# EAGLE design expansion (EAGLE 9.6.2)
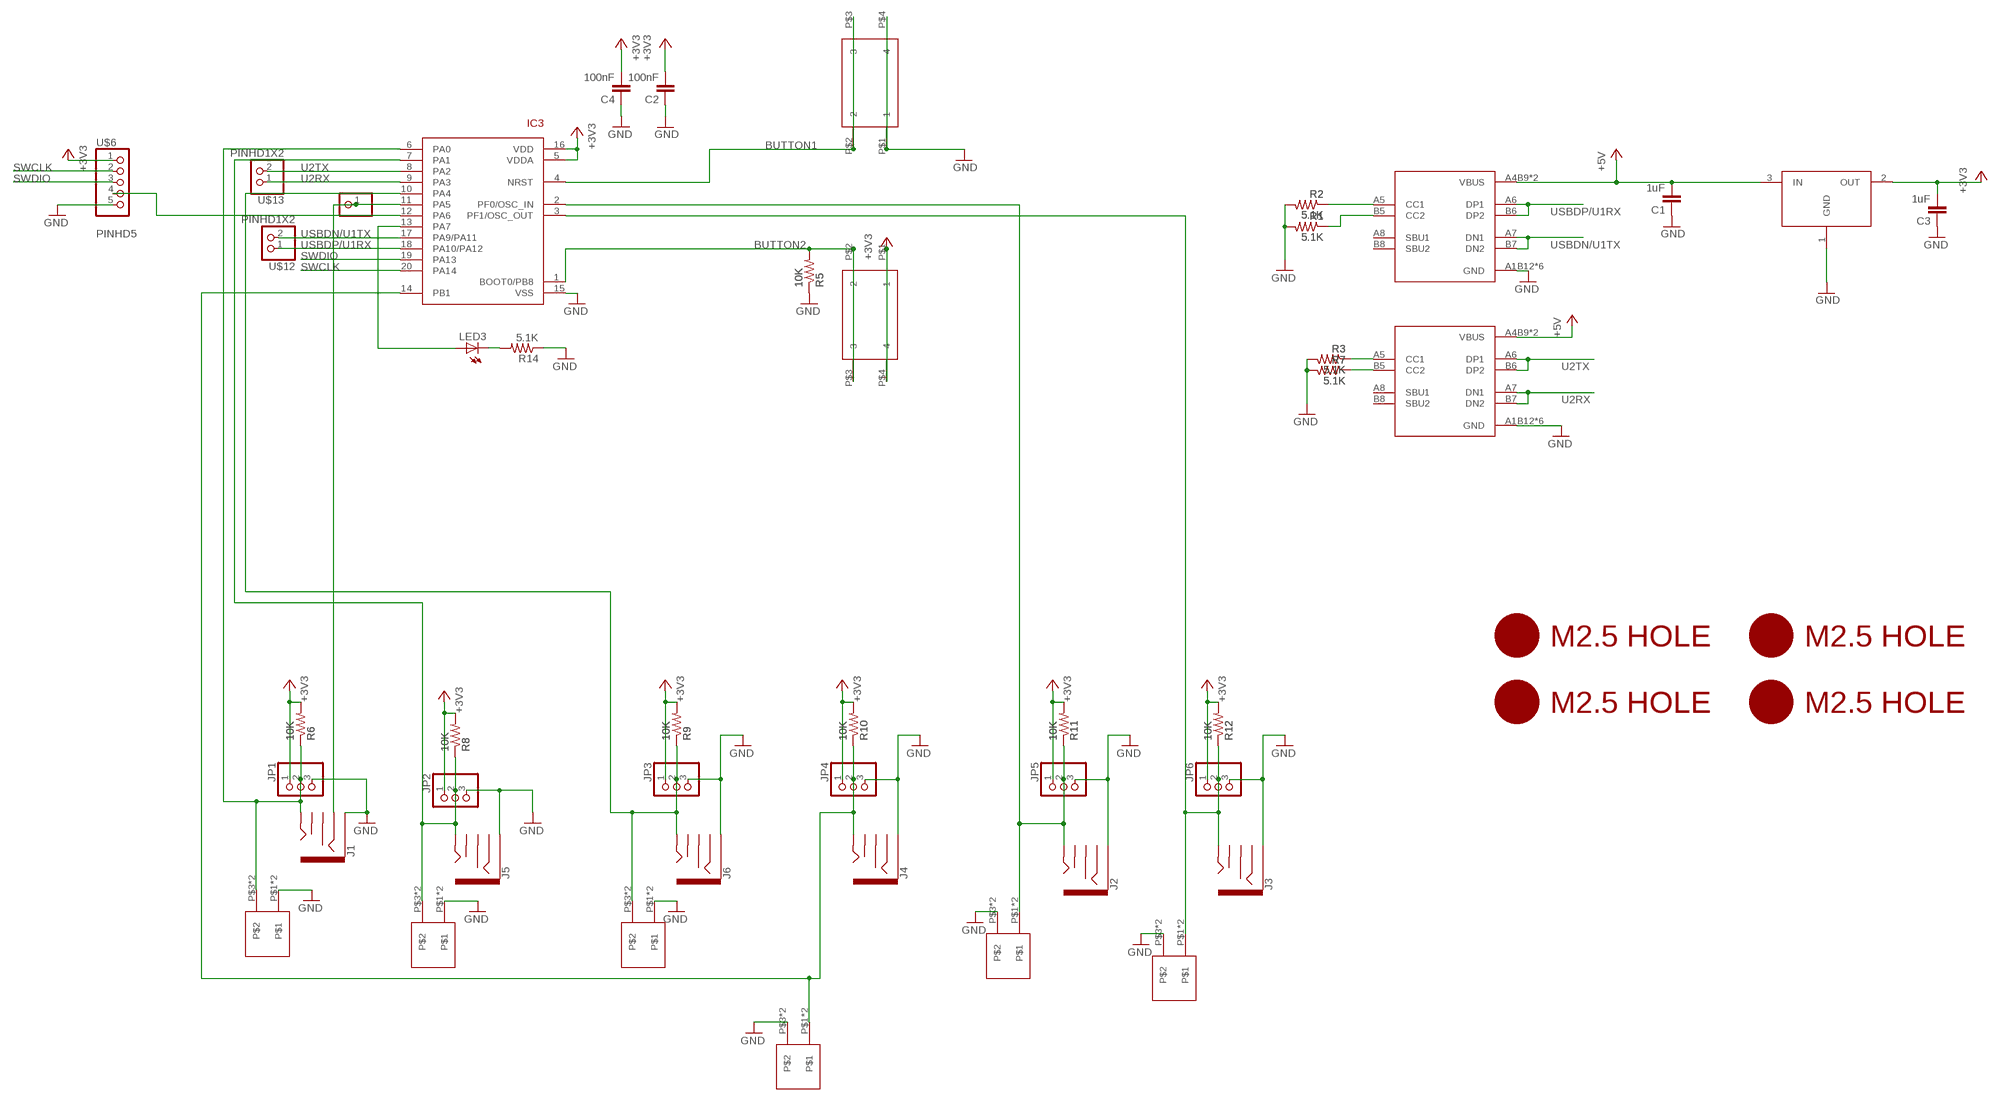
[diagram p0: schematic, sheet 1]

## Parts
C1  1uF  CAP0805  [0805]
C2  100nF  CAP0805  [0805]
C3  1uF  CAP0805  [0805]
C4  100nF  CAP0805  [0805]
IC3  STM32F042F4  [TSSOP20]
J1  AUDIO_JACK_3.5MM_PTH  [AUDIO-JACK]
J2  AUDIO_JACK_3.5MM_PTH  [AUDIO-JACK]
J3  AUDIO_JACK_3.5MM_PTH  [AUDIO-JACK]
J4  AUDIO_JACK_3.5MM_PTH  [AUDIO-JACK]
J5  AUDIO_JACK_3.5MM_PTH  [AUDIO-JACK]
J6  AUDIO_JACK_3.5MM_PTH  [AUDIO-JACK]
JP1  PINHD-1X3  [1X03]
JP2  PINHD-1X3  [1X03]
JP3  PINHD-1X3  [1X03]
JP4  PINHD-1X3  [1X03]
JP5  PINHD-1X3  [1X03]
JP6  PINHD-1X3  [1X03]
JP7  PINHD-1X1CB  [1X01-CLEANBIG]
LED3  LEDCHIP-LED0805  [CHIP-LED0805]
R1  5.1K  RESISTOR0805-RES  [0805]
R2  5.1K  RESISTOR0805-RES  [0805]
R3  5.1K  RESISTOR0805-RES  [0805]
R5  10K  RESISTOR0805-RES  [0805]
R6  10K  RESISTOR0805-RES  [0805]
R7  5.1K  RESISTOR0805-RES  [0805]
R8  10K  RESISTOR0805-RES  [0805]
R9  10K  RESISTOR0805-RES  [0805]
R10  10K  RESISTOR0805-RES  [0805]
R11  10K  RESISTOR0805-RES  [0805]
R12  10K  RESISTOR0805-RES  [0805]
R14  5.1K  RESISTOR0805-RES  [0805]
SW3  324_SW  [342_SWICH_FOOT]
SW4  324_SW  [342_SWICH_FOOT]
U1  USBC_16P  [USBC_16P_FOOT]
U2  USBC_16P  [USBC_16P_FOOT]
U4  XC6206_DEV  [SOT23R_INFINEON]
U$1  DG2204R-2  [DG2204R-2]
U$2  DG2204R-2  [DG2204R-2]
U$3  DG2204R-2  [DG2204R-2]
U$4  DG2204R-2  [DG2204R-2]
U$5  DG2204R-2  [DG2204R-2]
U$6  PINHD5  [1X05]
U$7  DG2204R-2  [DG2204R-2]
U$8  M2.5HOLE  [M2.5HOLE]
U$9  M2.5HOLE  [M2.5HOLE]
U$10  M2.5HOLE  [M2.5HOLE]
U$11  M2.5HOLE  [M2.5HOLE]
U$12  PINHD1X2  [1X02]
U$13  PINHD1X2  [1X02]

## Nets
+3V3: C2.2 C3.2 C4.2 IC3.5(VDDA) IC3.16(VDD) JP1.1 JP2.1 JP3.1 JP4.1 JP5.1 JP6.1 R6.2 R8.2 R9.2 R10.2 R11.2 R12.2 SW4.P$1 SW4.P$4 U4.2(OUT) U$6.1
+5V: C1.2 U1.A4B9(VBUS) U1.B4A9(VBUS) U2.A4B9(VBUS) U2.B4A9(VBUS) U4.3(IN)
BUTTON1: IC3.4(NRST) SW3.P$2 SW3.P$3
BUTTON2: IC3.1(BOOT0/PB8) R5.2 SW4.P$2 SW4.P$3
CH1: IC3.6(PA0) J1.TIP JP1.2 R6.1 U$4.P$3 U$4.P$4
CH2: IC3.7(PA1) J5.TIP JP2.2 R8.1 U$5.P$3 U$5.P$4
CH3: IC3.10(PA4) J6.TIP JP3.2 R9.1 U$7.P$3 U$7.P$4
CH4: IC3.14(PB1) J4.TIP JP4.2 R10.1 U$1.P$1 U$1.P$2
CH5: IC3.2(PF0/OSC_IN) J2.TIP JP5.2 R11.1 U$2.P$1 U$2.P$2
CH6: IC3.3(PF1/OSC_OUT) J3.TIP JP6.2 R12.1 U$3.P$1 U$3.P$2
GND: C1.1 C2.1 C3.1 C4.1 IC3.15(VSS) J1.SLEEVE J2.SLEEVE J3.SLEEVE J4.SLEEVE J5.SLEEVE J6.SLEEVE JP1.3 JP2.3 JP3.3 JP4.3 JP5.3 JP6.3 R1.2 R2.2 R3.2 R5.1 R7.2 R14.1 SW3.P$1 SW3.P$4 U1.A1B12(GND) U1.B11A12(GND) U1.P$13(GND) U1.P$14(GND) U1.P$15(GND) U1.P$16(GND) U2.A1B12(GND) U2.B11A12(GND) U2.P$13(GND) U2.P$14(GND) U2.P$15(GND) U2.P$16(GND) U4.1(GND) U$1.P$3 U$1.P$4 U$2.P$3 U$2.P$4 U$3.P$3 U$3.P$4 U$4.P$1 U$4.P$2 U$5.P$1 U$5.P$2 U$6.5 U$7.P$1 U$7.P$2
N$1: R3.1 U1.A5(CC1)
N$2: R7.1 U1.B5(CC2)
N$11: LED3.C R14.2
N$12: IC3.13(PA7) LED3.A
N$13: IC3.11(PA5) J1.RING JP7.1
N$14: IC3.12(PA6) U$6.4
N$31: R1.1 U2.B5(CC2)
N$33: R2.1 U2.A5(CC1)
SWCLK: IC3.20(PA14) U$6.2
SWDIO: IC3.19(PA13) U$6.3
U2RX: IC3.9(PA3) U1.A7(DN1) U1.B7(DN2) U$13.1
U2TX: IC3.8(PA2) U1.A6(DP1) U1.B6(DP2) U$13.2
USBDN/U1TX: IC3.17(PA9/PA11) U2.A7(DN1) U2.B7(DN2) U$12.2
USBDP/U1RX: IC3.18(PA10/PA12) U2.A6(DP1) U2.B6(DP2) U$12.1
Unconnected: J1.RSH J1.TSH J2.RING J2.RSH J2.TSH J3.RING J3.RSH J3.TSH J4.RING J4.RSH J4.TSH J5.RING J5.RSH J5.TSH J6.RING J6.RSH J6.TSH U1.A8(SBU1) U1.B8(SBU2) U2.A8(SBU1) U2.B8(SBU2)

## Library data of the parts
C1-C4 = clock:CAP: Capacitor Standard 0603 ceramic capacitor, and 0.1" leaded capacitor.
IC3 = tx:STM32F042F4
J1-J6 = SparkFun-Connectors:AUDIO_JACK_3.5MM: Audio Jack 3.5mm variants of PTH and SMT stereo audio jack with bypass switches. SparkFun Products: SparkFun SparkPunk Sound Kit <[https://www.sparkfun.com/products/11177]> - PTH MP3 Trigger <https://www.sparkfun.com/products/13720> -3.5mm SMD SparkFun PicoBoard <https://www.sparkfun.com/products/11888>- 2.5mm SMD; PROD_ID: CONN-08774; SF_ID: PRT-08032
JP1-JP6 = pinhead:PINHD-1X3: PIN HEADER
JP7 = adafruit_changed:PINHD-1X1: Pin header 1x1 for 0.1" spacing With round pins
LED3 = adafruit:LED: LED OSRAM: - CHIPLED LG R971, LG N971, LY N971, LG Q971, LY Q971, LO R971, LY R971 LH N974, LH R974 LS Q976, LO Q976, LY Q976 LO Q996 - Hyper CHIPLED LW Q18S LB Q993, LB Q99A, LB R99A - SideLED LS A670, LO A670, LY A670, LG A670, LP A670 LB A673, LV A673, LT A673, LW A673 LH A674 LY A675 LS A676, LA A676, LO A676, LY A676, LW A676 LS A679, LY A679, LG A679 - Hyper Micro SIDELED® LS Y876, LA Y876, LO Y876, LY Y876 LT Y87S - SmartLED LW L88C, LW L88S LB L89C, LB L89S, LG L890 LS L89K, LO L89K, LY L89K LS L896, LA L896, LO L896, LY L896 - TOPLED LS T670, LO T670, LY T670, LG T670, LP T670 LSG T670, LSP T670, LSY T670, LOP T670, LYG T670 LG T671, LOG T671, LSG T671 LB T673, LV T673, LT T673, LW T673 LH T674 LS T676, LA T676, LO T676, LY T676, LB T676, LH T676, LSB T676, LW T676 LB T67C, LV T67C, LT T67C, LS T67K, LO T67K, LY T67K, LW E67C LS E67B, LA E67B, LO E67B, LY E67B, LB E67C, LV E67C, LT E67C LW T67C LS T679, LY T679, LG T679 LS T770, LO T770, LY T770, LG T770, LP T770 LB T773, LV T773, LT T773, LW T773 LH T774 LS E675, LA E675, LY E675, LS T675 LS T776, LA T776, LO T776, LY T776, LB T776 LHGB T686 LT T68C, LB T68C - Hyper Mini TOPLED® LB M676 - Mini TOPLED Santana® LG M470 LS M47K, LO M47K, LY M47K Source: http://www.osram.convergy.de/
R1-R3 R5-R12 = joyAnalog:RESISTOR: Resistor Basic schematic elements and footprints for 0603, 1206, and PTH resistors.
R14 = SparkFun-Passives:RESISTOR: Resistor Basic schematic elements and footprints for 0603, 1206, and PTH resistors.
SW3 SW4 = 3pos_slide_switch_centered:324_SW
U1 U2 = my_usbc_16p:USBC_16P
U4 = 3pos_slide_switch:XC6206_DEV
U$1-U$5 U$7 = expansion:DG2204R-2
U$6 = adafruit_changed:PINHD5
U$8-U$11 = f1c100s:M2.5HOLE
U$12 U$13 = adafruit_changed:PINHD1X2

## Board
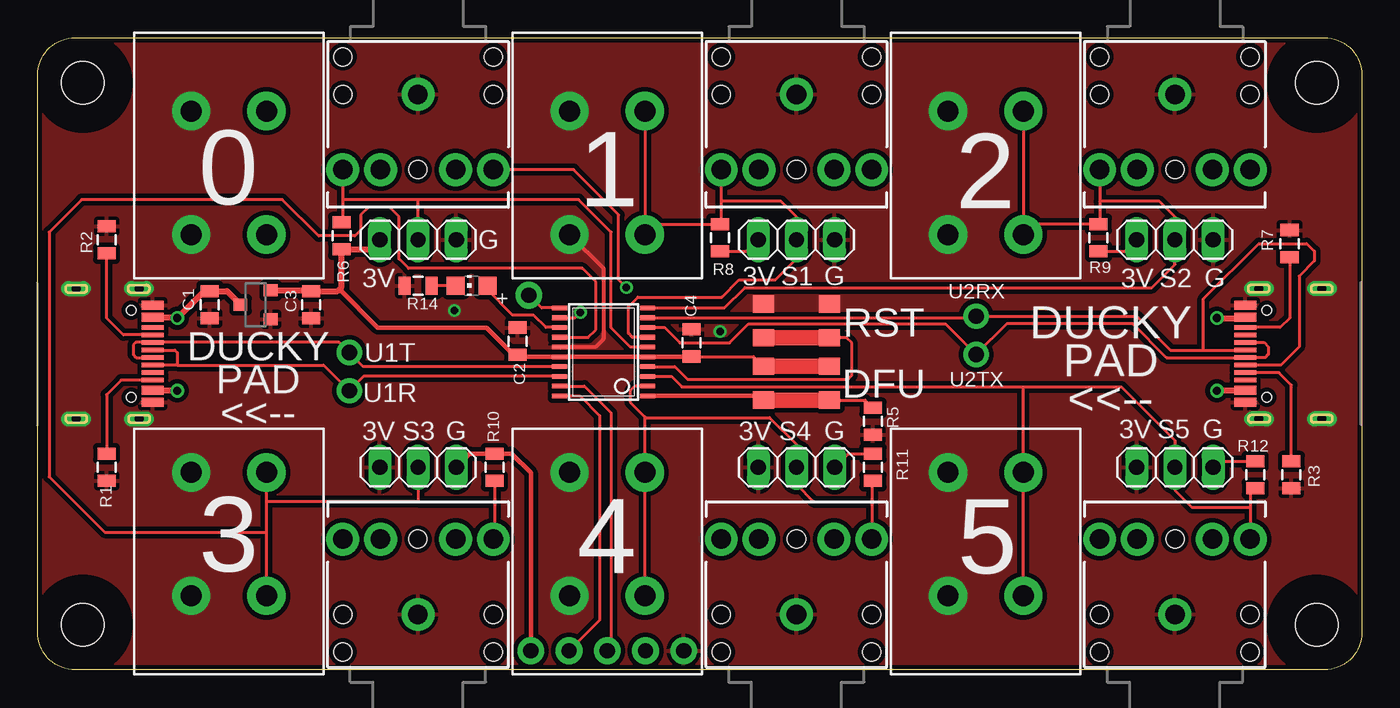
[diagram p1: board, top side]
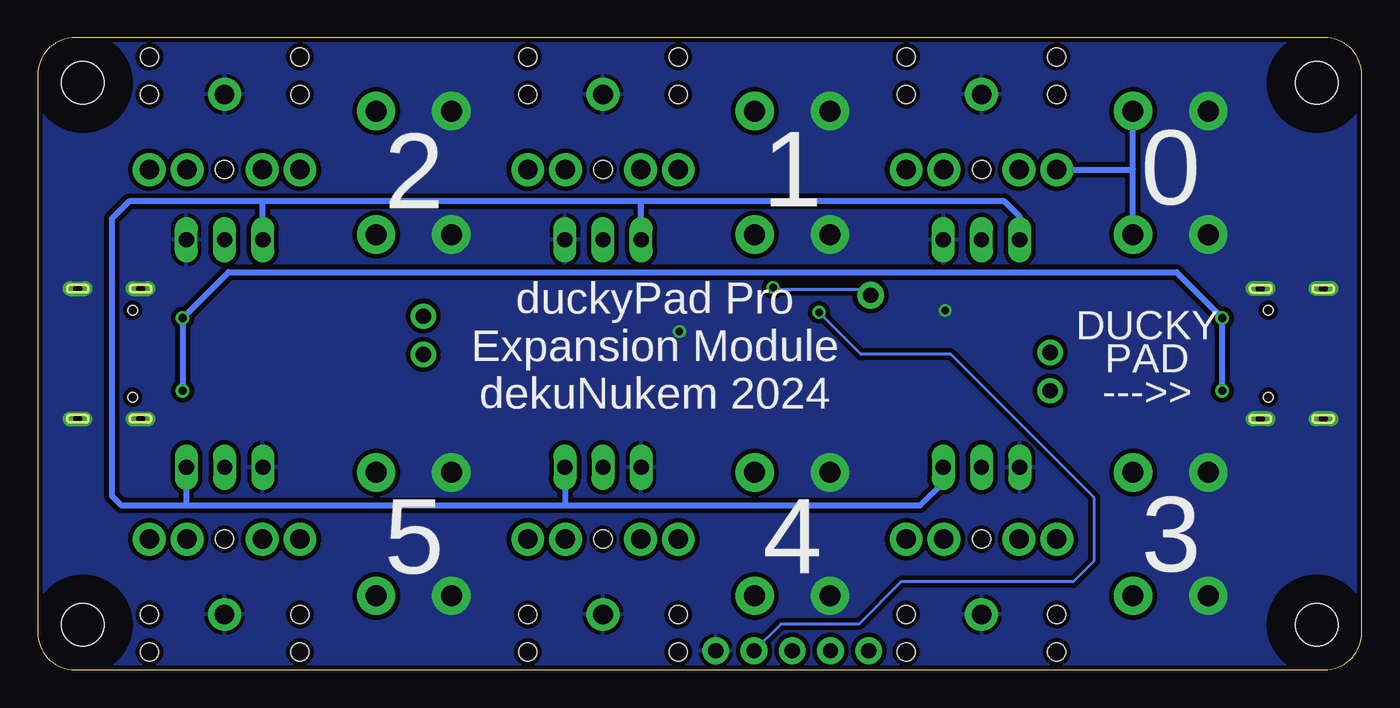
[diagram p2: board, bottom side, seen from below]

Size 88 x 42 mm. Coordinates in mm from the lower left corner, seen from the top.
Outline: 2.5,42 85.5,42 arc-90 88,39.5 88,2.5 arc-90 85.5,0 2.5,0 arc-90 0,2.5 0,39.5 arc-90 2.5,42
Copper layers (1*16): Top 0.035mm / dielectric 1.5mm / Bottom 0.035mm
Design rules "deku_2layer_6mil": minimum track width 6mil, minimum drill 15mil, track to track 6mil, track to pad 6mil, pad to pad 6mil, via to via 6mil, smd to smd 6mil, copper to edge 10mil, drill to drill 6mil, minimum pad ring 7mil, minimum via ring 7mil, stop-mask expansion 4mil, vias tented up to drill 25mil, thermal gap 10mil

### Footprints (pad centres in the part's own frame; a part is rotated, then mirrored left to right if it is on the bottom)
0805 = smd 0.8 x 1.2: 1 -0.9,0; 2 0.9,0
TSSOP20 = smd 0.305 x 0.991: 1 -2.925,-2.918; 2 -2.275,-2.918; 3 -1.625,-2.918; 4 -0.975,-2.918; 5 -0.325,-2.918; 6 0.325,-2.918; 7 0.975,-2.918; 8 1.625,-2.918; 9 2.275,-2.918; 10 2.925,-2.918; 11 2.925,2.918; 12 2.275,2.918; 13 1.625,2.918; 14 0.975,2.918; 15 0.325,2.918; 16 -0.325,2.918; 17 -0.975,2.918; 18 -1.625,2.918; 19 -2.275,2.918; 20 -2.925,2.918
AUDIO-JACK = drill 1.3 pad 2.184: RING 5,5; RSH 5,2.5; SLEEVE 0,0; TIP 5,-5; TSH 5,-2.5 | hole 1.2: 0,5; -2.5,5; -2.5,-5; 0,-5; 5,0
1X03 = drill 1.016 long: 1 -2.54,0; 2 0,0; 3 2.54,0
1X01-CLEANBIG = drill 1.016 pad 1.778: 1 0,0
CHIP-LED0805 = smd 1.2 x 1.2: A 0,-1.05; C 0,1.05
342_SWICH_FOOT = smd 1.4 x 1.15: P$1 -2.2,-1.125; P$2 -2.2,1.125; P$3 2.2,1.125; P$4 2.2,-1.125
USBC_16P_FOOT = smd 0.6 x 1.45: A1B12 -3.225,3.848; A4B9 -2.425,3.848; B4A9 2.425,3.848; B11A12 3.225,3.848 | smd 0.3 x 1.45: A5 -1.25,3.848; A6 -0.25,3.848; A7 0.25,3.848; A8 1.25,3.848; B5 1.75,3.848; B6 0.75,3.848; B7 -0.75,3.848; B8 -1.75,3.848 | drill 0.6 pad 1 long: P$13 -4.32,2.933; P$14 4.32,2.933; P$15 -4.32,-1.248; P$16 4.32,-1.248 | hole 0.65: -2.89,2.402; 2.89,2.402
SOT23R_INFINEON = smd 0.8 x 0.9: 1 -0.95,-1; 2 0.95,-1; 3 0,1
DG2204R-2 = drill 1.4 pad 2.54: P$1 -2.5,4.1; P$2 -2.5,-4.1; P$3 2.5,4.1; P$4 2.5,-4.1
1X05 = drill 1.016 pad 1.778: 1 -6.35,0; 2 -3.81,0; 3 -1.27,0; 4 1.27,0; 5 3.81,0
M2.5HOLE = hole 2.8: 0,0
1X02 = drill 1.016 pad 1.676: 1 -1.27,0; 2 1.27,0

### Placement (x,y rotation side)
C1  11.44,24.26 90 top
C2  31.88,21.84 270 top
C3  18.17,24.26 90 top
C4  43.44,21.72 270 top
IC3  37.61,21.12 90 top
J1  25.28,38.23 270 top
J2  50.43,3.68 90 top
J3  75.57,3.68 90 top
J4  25.28,3.68 90 top
J5  50.43,38.23 270 top
J6  75.57,38.23 270 top
JP1  25.28,28.57 0 top
JP2  50.43,28.57 0 top
JP3  75.57,28.57 0 top
JP4  25.28,13.46 180 top
JP5  50.43,13.46 180 top
JP6  75.57,13.46 180 top
JP7  32.65,24.89 0 top
LED3  28.84,25.53 90 top
R1  4.58,13.46 270 top
R2  4.58,28.57 90 top
R3  83.32,12.95 270 top
R5  55.51,16.51 90 top
R6  20.2,28.83 270 top
R7  83.19,28.32 90 top
R8  45.35,28.7 270 top
R9  70.49,28.7 270 top
R10  30.36,13.46 90 top
R11  55.51,13.46 90 top
R12  80.91,12.95 90 top
R14  25.28,25.53 0 top
SW3  50.43,23.19 180 top
SW4  50.43,19.05 180 top
U1  84.09,21 90 top
U2  3.81,21 270 top
U4  14.49,24.26 90 top
U$1  12.71,9.02 180 top
U$2  37.85,9.02 180 top
U$3  63,9.02 180 top
U$4  12.71,33.02 0 top
U$5  37.85,33.02 0 top
U$6  39.12,1.27 0 top
U$7  63,33.02 0 top
U$8  3,3 0 top
U$9  3,39 0 top
U$10  85,3 0 top
U$11  85,39 0 top
U$12  20.71,19.81 90 top
U$13  62.37,22.23 270 top

### Tracks (layer width: path | path; a pad name or v marks a point on that pad's centre or on a via)
+3V3
  Top 0.203: JP6.1 78.5,13.85 R12.2 | JP5.1 53.87,14.36 R11.2 | R9.2 72.26,27.8 JP3.1 | R8.2 47.11,27.8 JP2.1 | C4.2 47.59,20.82 SW4.P$4
  Top 0.305: C4.2 43.42,20.8 IC3.5 IC3.16 32.03,20.8 C2.2 31.63,20.94 29.83,22.74 22.6,22.74 20.06,25.28 | JP4.1 28.72,14.36 R10.2 31.49,14.36 32.77,13.08 U$6.1
  Top 0.406: JP1.1 22.09,27.93 R6.2 20.2,25.42 20.06,25.28 19.94,25.16 C3.2 18.12,25.21 U4.2
  Top 1.016: SW4.P$4 SW4.P$1
  Bottom 0.406: JP1.1 22.74,30.1 23.76,31.11 47.89,31.11 | JP2.1 47.89,31.11 | 78.11,10.92 82.43,10.92 83.07,11.56 83.07,29.97 81.92,31.11 73.03,31.11 | 78.11,10.92 52.97,10.92 | 52.97,10.92 29.34,10.92 27.82,12.45 JP4.1 | 47.89,31.11 73.03,31.11 | JP5.1 52.97,10.92 | JP6.1 78.11,10.92 | JP3.1 73.03,31.11
+5V  (via drill 0.55)
  Top 0.406: U4.3 12.59,25.16 C1.2 11.43,25.15 11.06,25.15 v9.28,23.37 9.22,23.43 U2.A4B9 | U2.B4A9 9.25,18.57 v9.28,18.54 | v78.37,23.37 80.19,23.37 U1.B4A9 | v78.37,18.54 78.4,18.57 U1.A4B9
  Bottom 0.406: v9.28,18.54 v9.28,23.37 12.33,26.42 75.32,26.42 v78.37,23.37 v78.37,18.54
BUTTON1
  Top 0.203: IC3.4 42.35,20.14 43.19,19.3 53.86,19.3 54.11,19.56 54.11,21.72 53.76,22.07 SW3.P$2
  Top 1.016: SW3.P$3 SW3.P$2
BUTTON2
  Top 0.203: SW4.P$2 54.99,17.93 R5.2
  Top 0.305: IC3.1 47.96,18.2 SW4.P$3
  Top 1.016: SW4.P$3 SW4.P$2
CH1
  Top 0.203: IC3.6 39.4,21.45 38.11,22.73 38.11,29.08 35.95,31.24 25.28,31.24 | J1.TIP 20.28,31.24 | 20.28,31.24 20.28,29.81 R6.1 | 25.28,31.24 20.28,31.24 | JP1.2 25.28,31.24
  Bottom 0.406: U$4.P$4 15.21,33.27 | 15.21,33.27 U$4.P$3 | J1.TIP 15.26,33.23 15.21,33.27
CH2
  Top 0.203: IC3.7 39.51,22.09 39.25,22.35 39.25,24.13 39.89,24.77 45.47,24.77 46.62,25.91 49.03,25.91 50.43,27.3 JP2.2 50.43,30.1 49.41,31.11 45.43,31.11 | J5.TIP 45.43,31.11 | 45.43,31.11 45.43,29.68 R8.1 41.04,29.6 U$5.P$4 U$5.P$3
CH3
  Top 0.203: IC3.10 45.64,24.05 47,25.4 74.05,25.4 75.57,26.92 JP3.2 75.57,30.1 74.56,31.11 70.57,31.11 | J6.TIP 70.57,31.11 | 70.57,31.11 70.57,29.68 R9.1 66.02,29.6 65.5,29.08 | U$7.P$3 65.5,29.08 | 65.5,29.08 U$7.P$4
CH4
  Top 0.203: IC3.14 36.58,22.09 37.09,22.61 37.09,25.78 36.2,26.67 24.65,26.67 24.01,27.3 24.01,30.1 23.38,30.73 21.98,30.73 21.47,30.23 21.47,29.21 21.09,28.83 18.68,28.83 16.26,31.24 2.93,31.24 0.77,29.08 0.77,12.83 4.45,9.14 15.21,9.14 | R10.1 30.36,11.18 | 30.36,11.18 30.36,8.76 J4.TIP | 25.28,11.18 30.36,11.18 | JP4.2 25.28,11.18 | 15.21,9.14 15.21,11.18 | 15.21,11.18 U$1.P$2 | U$1.P$1 15.21,9.14 | 25.28,11.18 15.21,11.18
CH5
  Top 0.203: IC3.2 39.68,18.84 39.38,18.54 39.38,17.78 40.33,16.83 40.35,16.8 | 40.35,16.8 40.39,16.76 48.65,16.76 50.43,14.99 JP5.2 50.43,12.32 51.57,11.18 55.43,11.18 | R11.1 55.43,12.48 55.43,11.18 | 55.43,11.18 J2.TIP | U$2.P$1 U$2.P$2 40.35,16.8
CH6
  Top 0.203: IC3.3 42.11,19.5 42.81,18.8 65.54,18.8 | 65.54,18.8 72.02,18.8 75.57,15.24 JP6.2 75.57,11.94 76.72,10.79 80.57,10.79 | 80.57,10.79 J3.TIP | R12.1 80.57,11.72 80.57,10.79 | U$3.P$1 U$3.P$2 65.5,18.76 65.54,18.8
GND  (via drill 0.5)
  Top 0.254: U$5.P$2 37.6,26.67 37.6,21.97 37.07,21.45 IC3.15
  other vias: 45.35,22.48 27.69,23.88
  pour Top (isolate 0.305): -11.35,56 -11.35,-12 116.14,-12 116.14,56
  pour Bottom (isolate 0.305): -10.5,51 105.5,51 105.5,-8 -10.5,-8
N$1
  Top 0.203: R3.1 83.32,18.92 82.49,19.75 U1.A5
N$2
  Top 0.203: R7.1 83.19,23.37 82.58,22.75 U1.B5
N$11
  Top 0.203: LED3.C R14.2
N$12
  Top 0.203: IC3.13 33.78,22.75 32.95,23.57 31.55,23.57 29.89,25.24 LED3.A
N$13  (via drill 0.5)
  Top 0.203: IC3.11 33.49,24.05 JP7.1 | v39.12,25.4 38.62,25.91 38.62,30.23 35.62,33.23 J1.RING
  Bottom 0.203: JP7.1 33.03,25.27 39,25.27 v39.12,25.4
N$14  (via drill 0.5)
  Top 0.203: IC3.12 35.72,23.39 v36.08,23.75
  Bottom 0.203: U$6.4 38.62,3.05 33.41,3.05 30.61,5.84 19.18,5.84 17.79,7.24 17.79,11.43 27.31,20.95 33.28,20.95 v36.08,23.75
N$31
  Top 0.203: U2.B5 5.54,19.25 4.58,18.29 R1.1
N$33
  Top 0.203: U2.A5 5.7,22.25 4.58,23.37 R2.1
SWCLK
  Top 0.203: IC3.20 36.04,18.2 37.35,16.89 37.35,3.3 U$6.2
SWDIO
  Top 0.203: IC3.19 36.34,18.84 38.11,17.08 38.11,1.52 U$6.3
U2RX
  Top 0.203: 77.48,21.25 75.28,21.25 73.03,23.5 U$13.1 62.27,23.39 IC3.9 | 77.48,21.25 U1.A7 | 77.48,21.25 77.48,24.64 81.16,28.32 84.34,28.32 84.84,27.81 84.84,27.18 83.83,26.16 83.83,21.46 82.61,20.25 U1.B7
U2TX
  Top 0.203: IC3.8 41.65,22.75 42.68,21.72 45.98,21.72 47.25,22.99 60.33,22.99 U$13.2 64.4,22.99 72.78,22.99 75.02,20.75 U1.A6 81.59,20.75 81.8,20.95 81.8,21.46 81.51,21.75 U1.B6
USBDN/U1TX
  Top 0.203: U2.A7 6.56,20.75 6.36,20.95 6.36,21.59 6.52,21.75 U2.B7 20.04,21.75 U$12.2 21.65,20.14 IC3.17
USBDP/U1RX
  Top 0.203: 9.28,20.25 19,20.25 U$12.1 21.66,19.5 IC3.18 | 9.28,20.25 U2.B6 | U2.A6 9.11,21.25 9.28,21.08 9.28,20.25

### Text on the board
tNames: 0 | 1 | 2 | G | 3V | 3V | S1 | G | 3V | S2 | G | U2RX | CLK | DIO | TX | G | 3V3 | RST | U1T | DUCKY / PAD / <<-- | DUCKY / PAD / <<-- | DFU | U2TX | U1R | PC | 3V | S3 | G | 3V | S4 | G | 3V | S5 | G | G | 3 | 4 | 5
bNames: 0 | 1 | 2 | duckyPad Pro / Expansion Module / dekuNukem 2024 | DUCKY / PAD / --->> | 3 | 4 | 5